# Altium schematic sheet Power.SchDoc: Power Distribution
size A4; ApprovedBy: Ayçin Erbil, Ayşe Hazal Demirci, Büşra Yılmaz, Ekrem Turan Fırat, Fatmanur Özen, Meryem Şen; CheckedBy: Ayçin Erbil, Ayşe Hazal Demirci, Büşra Yılmaz, Ekrem Turan Fırat, Fatmanur Özen, Meryem Şen; Author: Ayçin Erbil, Ayşe Hazal Demirci, Büşra Yılmaz, Ekrem Turan Fırat, Fatmanur Özen, Meryem Şen; CompanyName: Alpina Roket; DrawnBy: Av. Des. Tm.; Engineer: Ayçin Erbil, Ayşe Hazal Demirci, Büşra Yılmaz, Ekrem Turan Fırat, Fatmanur Özen, Meryem Şen; Organization: Alpina Roket; Address1: SCÜ; Address2: Merkez   /; Address3: Sivas; Address4: Türkiye; DocumentNumber: 0001; Revision: v0.0.1; SheetNumber: 3; SheetTotal: 13
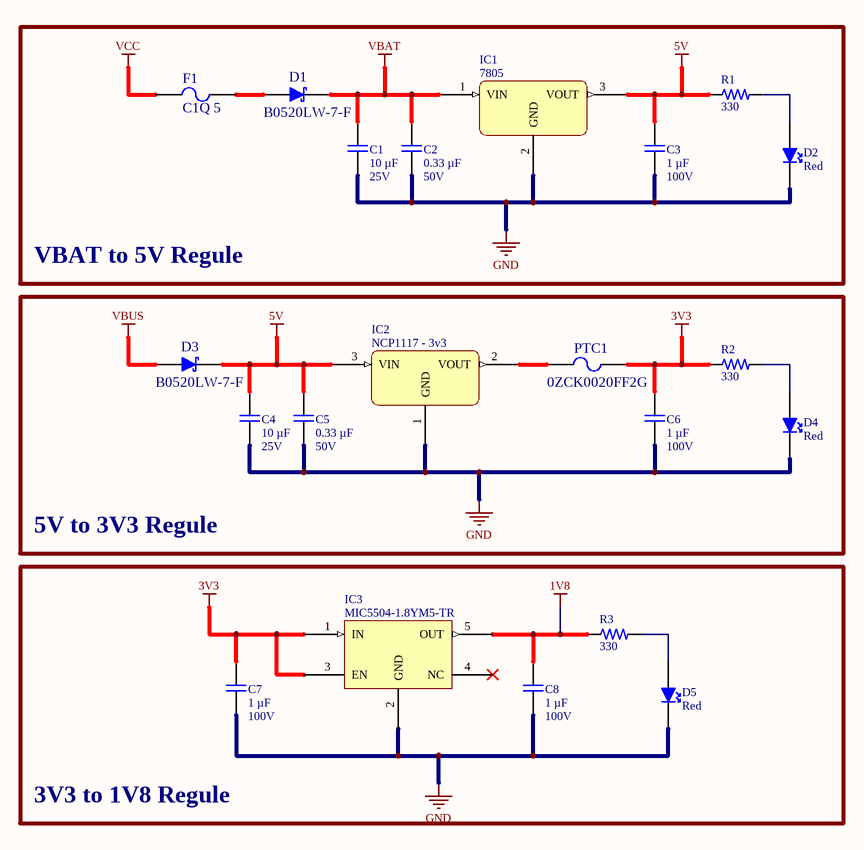
[diagram p0: Power.SchDoc]

## Parts
C1  10 µF  Voltage Rating: 25V  [MergenElektronik_Capacitors_Ceramics_SMDs_0603_L_NS]
C2  0.33 µF  Voltage Rating: 50V  [MergenElektronik_Capacitors_Ceramics_SMDs_0603_L_NS]
C3  1 µF  Voltage Rating: 100V  [MergenElektronik_Capacitors_Ceramics_SMDs_1206_M_NS]
C4  10 µF  Voltage Rating: 25V  [MergenElektronik_Capacitors_Ceramics_SMDs_0603_M_NS]
C5  0.33 µF  Voltage Rating: 50V  [MergenElektronik_Capacitors_Ceramics_SMDs_0603_M_NS]
C6  1 µF  Voltage Rating: 100V  [MergenElektronik_Capacitors_Ceramics_SMDs_1206_M_NS]
C7  1 µF  Voltage Rating: 100V  [MergenElektronik_Capacitors_Ceramics_SMDs_1206_M_NS]
C8  1 µF  Voltage Rating: 100V  [MergenElektronik_Capacitors_Ceramics_SMDs_1206_M_NS]
D1  B0520LW-7-F  [MergenElektronik_Diodes_SchottkyDiodes_SOD-523]
D2  Red  [MergenElektronik_Leds_SMDs_0603_M_NS]
D3  B0520LW-7-F  [MergenElektronik_Diodes_SchottkyDiodes_SOD-523]
D4  Red  [MergenElektronik_Leds_SMDs_0603_M_NS]
D5  Red  [MergenElektronik_Leds_SMDs_0603_M_NS]
F1  C1Q 5  [MergenElektronik_CircuitProtections_Fuses_1206_l]
IC1  7805  [MergenElektronik_Regulators_Linears_DPAK]
IC2  NCP1117 - 3v3  [MergenElektronik_Regulators_Linears_SOT223]
IC3  MIC5504-1.8YM5-TR  [MergenElektronik_Regulators_Linears_SOT-23-5]
PTC1  0ZCK0020FF2G  [MergenElektronik_CircuitProtections_PTCs_0805_M_NS]
R1  330  [MergenElektronik_Resistors_ChipResistors_0603_M_NS]
R2  330  [MergenElektronik_Resistors_ChipResistors_0603_M_NS]
R3  330  [MergenElektronik_Resistors_ChipResistors_0603_M_NS]

## Blocks framed on the sheet
VBAT to 5V Regule: C1-C3 D1 D2 F1 IC1 R1
5V to 3V3 Regule: C4-C6 D3 D4 IC2 PTC1 R2
3V3 to 1V8 Regule: C7 C8 D5 IC3 R3

## Nets
1V8: C8.1 IC3.5(OUT) R3.1
3V3: C6.1 C7.1 IC3.1(IN) IC3.3(EN) PTC1.2 R2.1
5V: C3.1 C4.1 C5.1 D3.2(KATOT) IC1.3(VOUT) IC2.3(VIN) R1.1
GND: C1.2 C2.2 C3.2 C4.2 C5.2 C6.2 C7.2 C8.2 D2.2(KATOT) D4.2(KATOT) D5.2(KATOT) IC1.2(GND) IC2.1(GND) IC3.2(GND)
VBAT: C1.1 C2.1 D1.2(KATOT) IC1.1(VIN)
VBUS: D3.1(ANOT)
VCC: F1.1
NetD1_1: D1.1(ANOT) F1.2
NetD2_1: D2.1(ANOT) R1.2
NetD4_1: D4.1(ANOT) R2.2
NetD5_1: D5.1(ANOT) R3.2
NetIC2_2: IC2.2(VOUT) PTC1.1

Not connected (* = marked no-connect by the designer): IC3 4(NC)*

## Notes on the sheet
- Title:
- Size:
- Date:
- A4
- Number:
- Time:
- Revision:
- Sheet
- of
- Project
- Drawn By :

## Library data of the parts
C1 C4 = MergenElektronik_Capacitors_Ceramic_SMDs_10µF_25V: Mergen Elektronik - Capacitors - Ceramics - SMDs - 0603 - 10 µF - 25V; Manufacturer: Murata Electronics; Manufacturer Number: GRT188R61E106ME13D; Model: Ceramic Capacitors; Tolerance: ±20%; Value: 10 µF; Temperature: -55°C up to +85°C; Digi-Key Number: 490-12323-1-ND; Package: 0603(1608); Farnell Number: 3581819; Mouser Number: 81-GRT188R61E106ME3D; Mounting Type: Surface Mount; Supplier 1: Digi-Key; Supplier 2: Mouser; Supplier Part Number 1: 490-12323-1-ND; Supplier Part Number 2: 81-GRT188R61E106ME3D
C2 C5 = MergenElektronik_Capacitors_Ceramic_SMDs_0.33µF_50V: Mergen Elektronik - Capacitors - Ceramics - SMDs - 0603 - 0.33 µF - 50V; Manufacturer: TDK Corporation; Manufacturer Number: C1608X7R1H334K080AC; Model: Ceramic Capacitors; Tolerance: ±10%; Value: 0.33 µF; Temperature: -55°C up to +125°C; Digi-Key Number: 445-5950-1-ND; Package: 0603(1608); Farnell Number: 2346907; Mouser Number: 810-C1608X7R1H334K; Mounting Type: Surface Mount; Supplier 1: Digi-Key; Supplier 2: Mouser; Supplier Part Number 1: 445-5950-1-ND; Supplier Part Number 2: 810-C1608X7R1H334K
C3 C6-C8 = MergenElektronik_Capacitors_Ceramic_SMDs_1µF_100V: Mergen Elektronik - Capacitors - Ceramics - SMDs - 1206 - 1 µF - 100V; Manufacturer: Samsung Electro-Mechanics; Manufacturer Number: CL31B105KCHNNNE; Model: Ceramic Capacitors; Tolerance: ±10%; Value: 1 µF; Temperature: -55°C up to +125°C; Digi-Key Number: 1276-1838-1-ND; Package: 1206(3216 Metric); Mouser Number: 187-CL31B105KCHNNNE; Mounting Type: Surface Mount; Özdisan Number: CL31B105KCHNNNE; Supplier 1: Digikey; Supplier 2: Mouser; Supplier Part Number 1: 1276-1838-1-ND; Supplier Part Number 2: 187-CL31B105KCHNNNE
D1 D3 = MergenElektronik_Diodes_SchottkyDiodes_B0520LW-7-F: Mergen Elektronik - Diodes - Schottky Diodes - B0520LW-7-F; Manufacturer: Diodes Incorporated; Breakdown Voltage: 20V; Current Rating: 500mA; Forward Voltage: 385 mV @ 500mA; Digi-Key Number: B0520LW-FDITR-ND; Manufacturer Number: B0520LW-7-F; Model: Schottky Diodes; Mounting Type: Surface Mount; Package: SOD-123; Temperature: -65°C up to +125°C; Value: B0520LW-7-F; Mouser Number: 621-B0520LW-F; Farnell Number: 1773476; Supplier 1: Digikey; Supplier 2: Mouser; Supplier Part Number 2: 621-B0520LW-F; Supplier Part Number 1: B0520LW-FDITR-ND
D2 D4 D5 = MergenElektronik_LEDs_SMDs_Red_0603: Mergen Elektronik - Leds - SMDs - Red - 0603; Manufacturer: Würth Elektronik; Manufacturer Number: 150060RS75000; Model: SMD Leds; Voltage Rating: 2V; Value: Red; Temperature: -45°C up to +85°C; Digi-Key Number: 732-4978-1-ND; Package: 0603(1608); Farnell Number: 2322071; Mouser Number: 710-150060RS75000; Mounting Type: Surface Mount; Color: Red; Özdisan Number: 150060RS75000; Supplier 1: Digi-Key; Supplier 2: Mouser; Supplier Part Number 1: 732-4978-1-ND; Supplier Part Number 2: 710-150060RS75000
F1 = MergenElektronik_CircuitProtections_Fuses_0C1Q 5: Mergen Elektronik - Circuit Protections - Fuses - 0C1Q 5; Manufacturer: Bel Fuse Inc.; Model: Fuse; Voltage Rating: 125V @ AC - 63V @ DC; Current Rating: 5 A; Breaking Capacity: 100A @ AC,- 50A @ DC; Melting I²t: 0.075; Response Time: Fast Blow; Digi-Key Number: 5923-C1Q5TR-ND; Manufacturer Number: C1Q 5; Mounting Type: Surface Mount; Mouser Number: 530-0ZCK0020FF2G; Package: 1206(3216); Temperature: -40°C up to 85°C; Value: C1Q 5; Supplier 1: Digi-Key; Supplier Part Number 1: 507-1811-6-ND
IC1 = MergenElektronik_Regulators_Linears_MC7805BDTG: Mergen Elektronik - Regulators - Linears - MC7805BDTG; Manufacturer: onsemi; Current Rating: 1A; Model: Linear; Output Voltage: 5V; Voltage Rating: 7VDC up to 36V; Temperature: -40°C up to +125°C; Value: MC7805BDTG; Mounting Type: Surface Mount; Digi-Key Number: MC7805BDTGOS-ND; Manufacturer Number: MC7805BDTG; Mouser Number: 863-MC7805BDTG; Özdisan Number: MC7805BDTG; Farnell Number: 1652336; Package: DPAK; Supplier 1: Digi-Key; Supplier 2: Mouser; Supplier Part Number 1: MC7805BDTGOS-ND; Supplier Part Number 2: 863-MC7805BDTG
IC2 = MergenElektronik_Regulators_Linears_NCP1117ST33T3G: Mergen Elektronik - Regulators - Linears - NCP1117ST33T3G; Manufacturer: onsemi; Current Rating: 1A; Model: Linear; Output Voltage: 3.3V; Voltage Rating: 4.75VDC up to 10V; Temperature: 0°C up to +125°C; Value: NCP1117ST33T3G; Mounting Type: Surface Mount; Digi-Key Number: NCP1117ST33T3GOSCT-ND; Manufacturer Number: NCP1117ST33T3G; Mouser Number: 863-NCP1117ST33T3G; Özdisan Number: NCP1117ST33T3G; Supplier 1: Digi-Key; Supplier 2: Mouser; Supplier Part Number 1: NCP1117ST33T3GOSCT-ND; Supplier Part Number 2: 863-NCP1117ST33T3G; Package: SOT-223
IC3 = MergenElektronik_Regulators_Linears_MIC5504-1.8YM5-TR: Mergen Elektronik - Regulators - Linears - MIC5504-1.8YM5-TR; Manufacturer: Microchip Technology; Current Rating: 300mA; Model: Linear; Output Voltage: 1.8V(Fixed); Voltage Rating: 2.2V up to 5.5V; Temperature: -40°C up to +125°C; Value: MIC5504-1.8YM5-TR; Mounting Type: Surface Mount; Digi-Key Number: 576-4879-2-ND; Manufacturer Number: MIC5504-1.8YM5-TR; Mouser Number: 998-MIC5504-1.8YM5TR; Farnell Number: 2809977; Package: SOT-23-5; Supplier 1: Digikey; Supplier 2: Mouser; Supplier Part Number 1: 576-4879-2-ND; Supplier Part Number 2: 998-MIC5504-1.8YM5TR
PTC1 = MergenElektronik_CircuitProtections_PTCs_0ZCK0020FF2G: Mergen Elektronik - Circuit Protections - PTCs - 0ZCK0020FF2G; Manufacturer: Bel Fuse Inc.; Model: PTC Fuse; Current Rating: 500 mA; Voltage Rating: 9V; Current - Max: 100A; Current - Hold: 200 mA; Digi-Key Number: 507-1811-1-ND; Manufacturer Number: 0ZCK0020FF2G; Mounting Type: Surface Mount; Mouser Number: 530-0ZCK0020FF2G; Package: 0805(2012); Temperature: -40°C up to 85°C; Value: 0ZCK0020FF2G; Supplier 1: Digi-Key; Supplier Part Number 1: 507-1811-6-ND; Current - Trip: 500 mA; Supplier 2: Mouser; Supplier Part Number 2: 530-0ZCK0020FF2G
R1-R3 = MergenElektronik_Resistors_ChipResistors_0603_330R: Mergen Elektronik - Resistors - Chip Resistors - 0603 - 330R; Manufacturer: Stackpole Electronics Inc; Manufacturer Number: RMCF0603JT330R; Value: Chip Resistor - 0603 - 330R; Power: 1/10W; Tolerance: ±5%; Package: 0603(1608); Temperature: -55°C up to +155°C - X8R; Model: Chip Resistor; Digi-Key Number: RMCF0603JT330RCT-ND; Mounting Type: Surface Mount; Supplier 1: Digi-Key; Supplier Part Number 1: RMCF0603JT330RCT-ND